# Altium project T1_Card.PrjPcb (part 6 of 6)
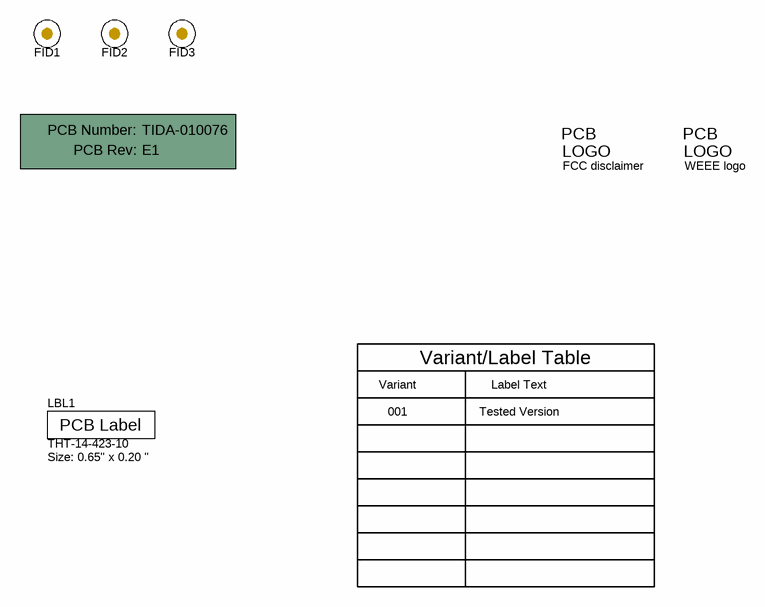
[diagram p14: Hardware.SchDoc]

## Nets that join several sheets
AGND: T1_Card_Top (37 pins), T1_Data_Top_Level (21 pins), U_T1_Card_Top/U_T1_Data_Top_Level/P1 (17 pins), U_T1_Card_Top/U_T1_Data_Top_Level/P2 (17 pins)
ILIM_GND: T1_Card_Top (9 pins), T1_Power_Top_Level (18 pins), LM76003 (NT3.1), LMZM33603 (NT4.1), LMZ10500 (NT6.1), INA180 (NT9.1), LM74700 (C6.2 C7.2 U2.2), U_T1_Card_Top/U_T1_Power_Top_Level/F1 (13 pins), U_T1_Card_Top/U_T1_Power_Top_Level/F2 (13 pins), LP2951 (6 pins), TLC6C598_Q1 (10 pins)
PHY_VDD: T1_Card_Top (J1.2 R1.2), T1_Data_Top_Level (18 pins), U_T1_Card_Top/U_T1_Data_Top_Level/P1 (6 pins), U_T1_Card_Top/U_T1_Data_Top_Level/P2 (6 pins)
5V_out: LMZM33603 (10 pins), LMZ10500 (6 pins)
48V_Supply_In: T1_Power_Top_Level (D1.2 D28.2), LM74700 (7 pins)
48V_Vin: LM76003 (8 pins), LM74700 (7 pins), U_T1_Card_Top/U_T1_Power_Top_Level/F1 (9 pins), U_T1_Card_Top/U_T1_Power_Top_Level/F2 (9 pins), LP2951 (D14.1)
48V_Vout: U_T1_Card_Top/U_T1_Power_Top_Level/F1 (9 pins), U_T1_Card_Top/U_T1_Power_Top_Level/F2 (9 pins)
CLKOUT: U_T1_Card_Top/U_T1_Data_Top_Level/P1 (U13_P1.16), U_T1_Card_Top/U_T1_Data_Top_Level/P2 (U13_P2.16)
ILIM: U_T1_Card_Top/U_T1_Power_Top_Level/F1 (TP7_F1.1 U3_F1.10), U_T1_Card_Top/U_T1_Power_Top_Level/F2 (TP7_F2.1 U3_F2.10)
IMON: U_T1_Card_Top/U_T1_Power_Top_Level/F1 (C71_F1.1 R13_F1.2 TP6_F1.1 U3_F1.13), U_T1_Card_Top/U_T1_Power_Top_Level/F2 (C71_F2.1 R13_F2.2 TP6_F2.1 U3_F2.13)
MSP_3V3: T1_Power_Top_Level (C4.1 U1.1), INA180 (R106.1), LP2951 (C47.1 R33.1 R34.2), TLC6C598_Q1 (R105.2)
PG: U_T1_Card_Top/U_T1_Power_Top_Level/F1 (D10_F1.2 R7_F1.1 U3_F1.16), U_T1_Card_Top/U_T1_Power_Top_Level/F2 (D10_F2.2 R7_F2.1 U3_F2.16)
PHY_LED1_: U_T1_Card_Top/U_T1_Data_Top_Level/P1 (U13_P1.6), U_T1_Card_Top/U_T1_Data_Top_Level/P2 (U13_P2.6)
PHY_N: U_T1_Card_Top/U_T1_Data_Top_Level/P1 (C67_P1.1 R95_P1.2), U_T1_Card_Top/U_T1_Data_Top_Level/P2 (C67_P2.1 R95_P2.2)
PHY_P: U_T1_Card_Top/U_T1_Data_Top_Level/P1 (C64_P1.1 R96_P1.2), U_T1_Card_Top/U_T1_Data_Top_Level/P2 (C64_P2.1 R96_P2.2)
PHY_VDD_1V: U_T1_Card_Top/U_T1_Data_Top_Level/P1 (L11_P1.1), U_T1_Card_Top/U_T1_Data_Top_Level/P2 (L11_P2.1)
PRU0_MDC: U_T1_Card_Top/U_T1_Data_Top_Level/P1 (U13_P1.1), U_T1_Card_Top/U_T1_Data_Top_Level/P2 (U13_P2.1)
PRU0_MDIO: U_T1_Card_Top/U_T1_Data_Top_Level/P1 (U13_P1.36), U_T1_Card_Top/U_T1_Data_Top_Level/P2 (U13_P2.36)
PRU0_MII_INH: U_T1_Card_Top/U_T1_Data_Top_Level/P1 (R88_P1.1 U13_P1.10), U_T1_Card_Top/U_T1_Data_Top_Level/P2 (R88_P2.1 U13_P2.10)
PRU0_MII_INT: U_T1_Card_Top/U_T1_Data_Top_Level/P1 (R89_P1.1 U13_P1.2), U_T1_Card_Top/U_T1_Data_Top_Level/P2 (R89_P2.1 U13_P2.2)
PRU0_MII_RESETn: U_T1_Card_Top/U_T1_Data_Top_Level/P1 (R90_P1.1 U13_P1.3), U_T1_Card_Top/U_T1_Data_Top_Level/P2 (R90_P2.1 U13_P2.3)
PRU0_MII_RX_CLK: U_T1_Card_Top/U_T1_Data_Top_Level/P1 (R100_P1.1 TP14_P1.1), U_T1_Card_Top/U_T1_Data_Top_Level/P2 (R100_P2.1 TP14_P2.1)
PRU0_MII_RX_D0_: U_T1_Card_Top/U_T1_Data_Top_Level/P1 (R101_P1.1 TP15_P1.1), U_T1_Card_Top/U_T1_Data_Top_Level/P2 (R101_P2.1 TP15_P2.1)
PRU0_MII_RX_D1_: U_T1_Card_Top/U_T1_Data_Top_Level/P1 (R102_P1.1), U_T1_Card_Top/U_T1_Data_Top_Level/P2 (R102_P2.1)
PRU0_MII_RX_D2_: U_T1_Card_Top/U_T1_Data_Top_Level/P1 (R103_P1.1), U_T1_Card_Top/U_T1_Data_Top_Level/P2 (R103_P2.1)
PRU0_MII_RX_D3_: U_T1_Card_Top/U_T1_Data_Top_Level/P1 (R104_P1.1), U_T1_Card_Top/U_T1_Data_Top_Level/P2 (R104_P2.1)
PRU0_MII_RXDV: U_T1_Card_Top/U_T1_Data_Top_Level/P1 (R99_P1.1 TP13_P1.1), U_T1_Card_Top/U_T1_Data_Top_Level/P2 (R99_P2.1 TP13_P2.1)
PRU0_MII_RXER: U_T1_Card_Top/U_T1_Data_Top_Level/P1 (R98_P1.1 TP12_P1.1), U_T1_Card_Top/U_T1_Data_Top_Level/P2 (R98_P2.1 TP12_P2.1)
PRU0_MII_RXLINK: U_T1_Card_Top/U_T1_Data_Top_Level/P1 (U13_P1.35), U_T1_Card_Top/U_T1_Data_Top_Level/P2 (U13_P2.35)
PRU0_MII_TX_CLK: U_T1_Card_Top/U_T1_Data_Top_Level/P1 (R94_P1.1 TP9_P1.1), U_T1_Card_Top/U_T1_Data_Top_Level/P2 (R94_P2.1 TP9_P2.1)
PRU0_MII_TX_D0_: U_T1_Card_Top/U_T1_Data_Top_Level/P1 (TP11_P1.1 U13_P1.33), U_T1_Card_Top/U_T1_Data_Top_Level/P2 (TP11_P2.1 U13_P2.33)
PRU0_MII_TX_D1_: U_T1_Card_Top/U_T1_Data_Top_Level/P1 (U13_P1.32), U_T1_Card_Top/U_T1_Data_Top_Level/P2 (U13_P2.32)
PRU0_MII_TX_D2_: U_T1_Card_Top/U_T1_Data_Top_Level/P1 (U13_P1.31), U_T1_Card_Top/U_T1_Data_Top_Level/P2 (U13_P2.31)
PRU0_MII_TX_D3_: U_T1_Card_Top/U_T1_Data_Top_Level/P1 (U13_P1.30), U_T1_Card_Top/U_T1_Data_Top_Level/P2 (U13_P2.30)
PRU0_MII_TX_EN: U_T1_Card_Top/U_T1_Data_Top_Level/P1 (TP10_P1.1 U13_P1.29), U_T1_Card_Top/U_T1_Data_Top_Level/P2 (TP10_P2.1 U13_P2.29)
SGND: U_T1_Card_Top/U_T1_Power_Top_Level/F1 (7 pins), U_T1_Card_Top/U_T1_Power_Top_Level/F2 (7 pins)
SHDN: U_T1_Card_Top/U_T1_Power_Top_Level/F1 (U3_F1.12), U_T1_Card_Top/U_T1_Power_Top_Level/F2 (U3_F2.12)
XI: U_T1_Card_Top/U_T1_Data_Top_Level/P1 (U13_P1.5), U_T1_Card_Top/U_T1_Data_Top_Level/P2 (U13_P2.5)
XO: U_T1_Card_Top/U_T1_Data_Top_Level/P1 (U13_P1.4), U_T1_Card_Top/U_T1_Data_Top_Level/P2 (U13_P2.4)

## Assembly variants
001: not fitted C65_P1 C65_P2 C66_P1 C66_P2 D17 D18 D20 D23 FID1 FID2 FID3 L11_P1 L11_P2 R52 R54 R55 R56 R57 R58 R59 R60 R61 R63 R64 R67 R68 R69 R70 R71 R72 R73 R78 R79 R80 R81 R82 R83 R84 R92_P1 R92_P2